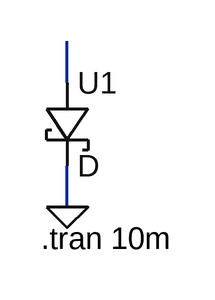
[diagram p0: schematic Draft1.asc]
Draft1.asc, the LTspice schematic file:
Version 4
SHEET 1 880 680
WIRE 32 160 32 128
WIRE 32 256 32 224
FLAG 32 256 0
SYMBOL ESM\\Diode\\S310FA 16 160 R0
SYMATTR InstName U1
TEXT 12 280 Left 2 !.tran 10m

The netlist it stands for:
* Draft1.asc
XU1 N001 0 S310FA D  ; pins A K
.tran 10m
.lib ESM\Diode\S310FA.LIB
.backanno
.end